# EAGLE design sharp_breakout_v1 (EAGLE 9.6.2)
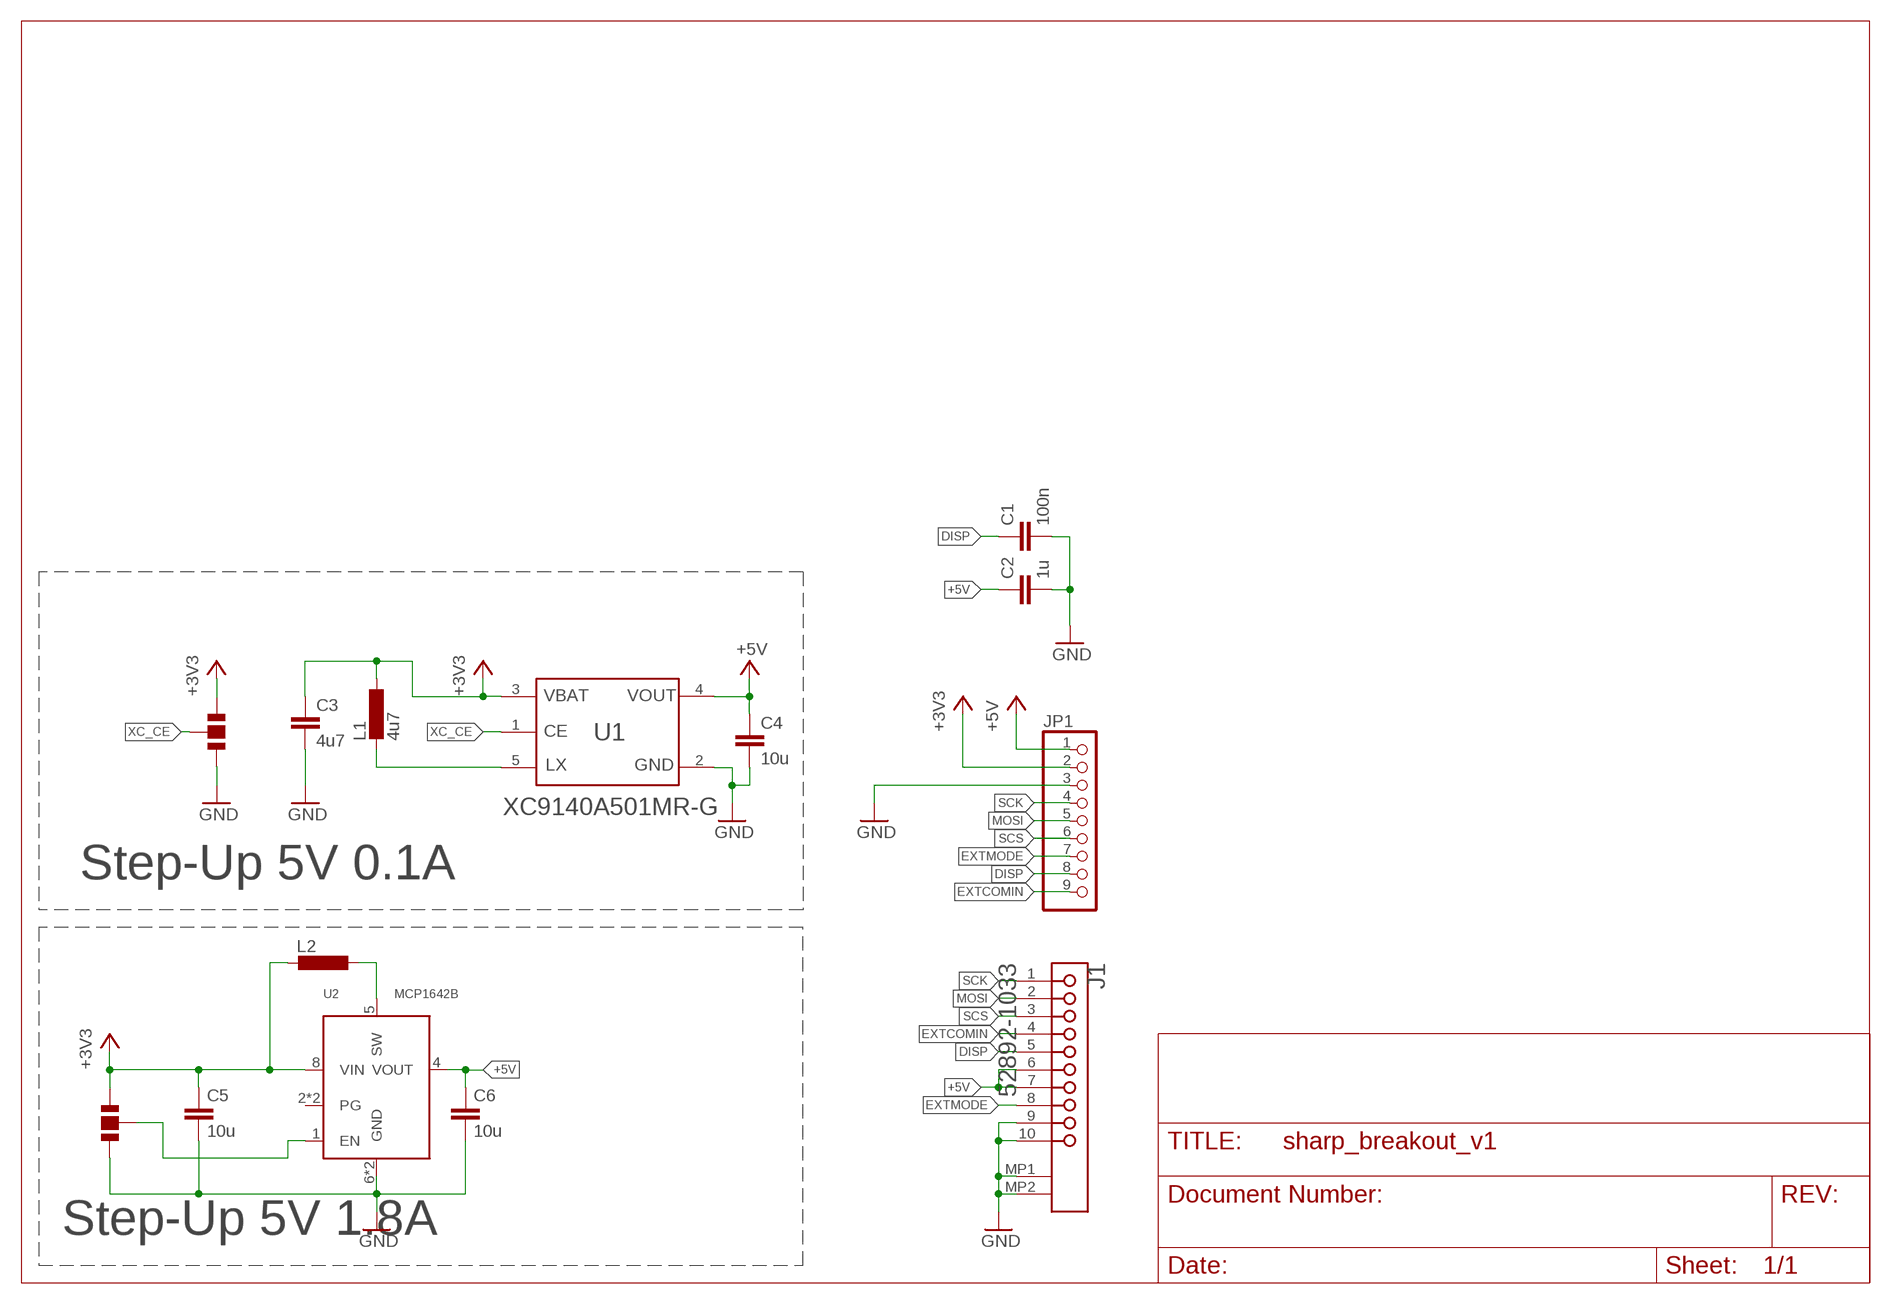
[diagram p0: schematic, sheet 1]

## Parts
C1  100n  C-EUC0603K  [C0603K]
C2  1u  C-EUC0603K  [C0603K]
C3  4u7  C-EUC0603K  [C0603K]
C4  10u  C-EUC0603K  [C0603K]
C5  10u  C-EUC1206  [C1206]
C6  10u  C-EUC1206  [C1206]
J1  MOLEX_52892-1033MOLEX_52892-1033_0_0  [MOLEX_52892-1033_0]
JP1  PINHD-1X9  [1X09]
L1  4u7  L-EUL3225M  [L3225M]
L2  L-EUL4532P  [L4532P]
U1  TOREX_XC9140A501MR-GTOREX_XC9140A501MR-G_0_0  [TOREX_XC9140A501MR-G_0]
U2  MCP1642B  [MSOP8]
U$1  JUMPER  [2-WAY]
U$7  JUMPER  [2-WAY]

## Nets
+3V3: C3.1 C5.1 JP1.2 L1.1 L2.2 U1.3(VBAT) U2.8(VIN) U$1.P$3 U$7.P$2
+5V: C2.1 C4.1 C6.1 J1.6 J1.7 JP1.1 U1.4(VOUT) U2.4(VOUT)
DISP: C1.1 J1.5 JP1.8
EXTCOMIN: J1.4 JP1.9
EXTMODE: J1.8 JP1.7
GND: C1.2 C2.2 C3.2 C4.2 C5.2 C6.2 J1.9 J1.10 J1.MP1 J1.MP2 JP1.3 U1.2(GND) U2.6(GND) U2.7(GND) U$1.P$2 U$7.P$3
MOSI: J1.2 JP1.5
N$4: L1.2 U1.5(LX)
N$21: L2.1 U2.5(SW)
N$23: U2.1(EN) U$7.P$1
SCK: J1.1 JP1.4
SCS: J1.3 JP1.6
XC_CE: U1.1(CE) U$1.P$1
Unconnected: U2.2(PG) U2.3(PG)

## Notes on the sheet
- Step-Up 5V 0.1A
- Step-Up 5V 1.8A

## Library data of the parts
C1-C6 = rcl:C-EU: CAPACITOR, European symbol; SPICEPREFIX: C
J1 = Bastlir:MOLEX_52892-1033: MOLX-52892-1033; CIIVA_IDS: 12958041; CIRCUITS_LOADED: 10; COMPONENT_LINK_1_DESCRIPTION: Manufacturer URL; COMPONENT_LINK_1_URL: http://www.molex.com/molex/index.jsp; COMPONENT_LINK_3_DESCRIPTION: Package Specification; COMPONENT_LINK_3_URL: http://www.molex.com/pdm_docs/sd/528921033_sd.pdf; CONTACT_POSITION: Bottom; CURRENT_MAX_PER_CONTACT: 0.5A; DATASHEET: http://www.molex.com/webdocs/datasheets/pdf/en-us/0528921033_FFC_FPC_CONNECTORS.pdf; DURABILITY_MATING_CYCLES_MAX: 20; ENTRY_ANGLE: 90degrees Angle; FOOTPRINT_VARIANT_NAME_0: Manufacturer Recommended; IMPORTED: yes; IMPORTED_FROM: vault; IMPORT_TS: 1521861772; MATED_HEIGHT: 2.00mm; MATERIAL___METAL: Phosphor Bronze; MATERIAL___PLATING_MATING: Silver, Tin-Bismuth; MATERIAL___PLATING_TERMINATION: Silver, Tin-Bismuth; MF: Molex; MOUNTING_TECHNOLOGY: Surface Mount; MPN: 52892-1033; NUMBER_OF_ROWS: 1; ORIENTATION: Right Angle; PACKAGE: 52892-1033; PACKAGE_DESCRIPTION: 10-Lead FPC Connector, Pitch 0.5 mm; PACKAGE_VERSION: Rev. A, 05/2013; PACKING: Tape and Reel; PCB_LOCATOR: No; PCB_RETENTION: Yes; PITCH___MATING_INTERFACE: 0.50mm; PITCH___TERMINATION_INTERFACE: 0.50mm; POLARIZED_TO_PCB: No; PREFIX: J; RELEASE_DATE: 1411372666; ROHS: Yes; STACKABLE: No; VAULT_GUID: ED90F1F9-BF1F-41FB-8C24-080009F071BA; VAULT_REVISION: 2519BB65-6747-4A90-BA56-D26D50506A67; VOLTAGE_MAX: 50V
JP1 = pinhead:PINHD-1X9: PIN HEADER
L1 L2 = rcl:L-EU: INDUCTOR, European symbol; SPICEPREFIX: L
U1 = Bastlir:TOREX_XC9140A501MR-G: Boost Switching Regulator IC Positive Fixed 5V 1 Output 295mA (Switch) SC-74A, SOT-753; AMBIENT_TEMPERATURE_RANGE_HIGH: +85°C; AMBIENT_TEMPERATURE_RANGE_LOW: -40°C; AUTOMOTIVE: No; CENTROID_NOT_SPECIFIED: No; DATASHEET: http://www.torexsemi.com/products/dcdc_converters/data/XC9140.pdf; DEVICE_CLASS_L1: Integrated Circuits (ICs); DEVICE_CLASS_L2: Power Management ICs; DEVICE_CLASS_L3: Voltage Regulators - Switching; DIGIKEY_DESCRIPTION: IC REG BOOST 5V 295MA SOT25; DIGIKEY_PART_NUMBER: 893-1181-1-ND; FOOTPRINT_PARAMETERS_1: {"fp_type":"SOT23","params":{"N":{"default":"5","long name":"Number of leads","type":"multichoice","short name":"N"},"A":{"nom":false,"long name":"Height","min":false,"max":1300000,"short name":"A","type":"measurement"},"A1":{"nom":50000,"long name":"Package clearance","min":0,"max":100000,"short name":"A1","type":"measurement"},"A2":{"nom":1100000,"long name":"Package height","min":1000000,"max":1200000,"short name":"A2","type":"measurement"},"D":{"nom":2900000,"long name":"Package length","min":2700000,"max":3100000,"short name":"D","type":"measurement"},"E":{"nom":2800000,"long name":"Width /w leads","min":2600000,"max":3000000,"short name":"E","type":"measurement"},"E1":{"nom":1600000,"long name":"Package width","min":1500000,"max":1800000,"short name":"E1","type":"measurement"},"B":{"nom":400000,"long name":"Lead width","min":350000,"max":500000,"short name":"B","type":"measurement"},"C":{"nom":150000,"long name":"Lead thickness","min":100000,"max":250000,"short name":"C","type":"measurement"},"L":{"nom":false,"long name":"Lead foot length","min":200000,"max":false,"short name":"L","type":"measurement"},"e":{"nom":950000,"long name":"Lead pitch","min":null,"max":null,"short name":"e","type":"measurement"},"PHI":{"nom":false,"long name":"Lead angle","min":0,"max":8,"short name":"PHI","type":"measurement"},"offset x":{"nom":0,"long name":"X Center offset","min":null,"max":null,"short name":"offset x","type":"measurement"},"offset y":{"nom":0,"long name":"Y Center offset","min":null,"max":null,"short name":"offset y","type":"measurement"},"LS":{"default":"Rounded rectangle","long name":"Land shape","type":"multichoice","short name":"LS"},"LS1":{"default":"Rectangle","long name":"Land shape (Pin 1)","type":"multichoice","short name":"LS1"},"solder toe":{"nom":550000,"long name":"Solder fillet (toe)","min":null,"max":null,"short name":"solder toe","type":"fixedmeasurement"},"solder heel":{"nom":450000,"long name":"Solder fillet (heel)","min":null,"max":null,"short name":"solder heel","type":"fixedmeasurement"},"solder side":{"nom":50000,"long name":"Solder fillet (side)","min":null,"max":null,"short name":"solder side","type":"fixedmeasurement"},"courtyard":{"nom":500000,"long name":"Courtyard","min":null,"max":null,"short name":"courtyard","type":"fixedmeasurement"},"SF":{"default":"A","long name":"Packing level","type":"multichoiceparent","short name":"SF","help":"http://support.upverter.com/customer/portal/articles/978783-what-is-a-footprint-packing-level","children":["solder toe","solder heel","solder side","courtyard"]}}}; FOOTPRINT_PARAMETERS_2: {"fp_type":"SOT23","params":{"N":{"default":"5","long name":"Number of leads","type":"multichoice","short name":"N"},"A":{"nom":false,"long name":"Height","min":false,"max":1300000,"short name":"A","type":"measurement"},"A1":{"nom":50000,"long name":"Package clearance","min":0,"max":100000,"short name":"A1","type":"measurement"},"A2":{"nom":1100000,"long name":"Package height","min":1000000,"max":1200000,"short name":"A2","type":"measurement"},"D":{"nom":2900000,"long name":"Package length","min":2700000,"max":3100000,"short name":"D","type":"measurement"},"E":{"nom":2800000,"long name":"Width /w leads","min":2600000,"max":3000000,"short name":"E","type":"measurement"},"E1":{"nom":1600000,"long name":"Package width","min":1500000,"max":1800000,"short name":"E1","type":"measurement"},"B":{"nom":400000,"long name":"Lead width","min":350000,"max":500000,"short name":"B","type":"measurement"},"C":{"nom":150000,"long name":"Lead thickness","min":100000,"max":250000,"short name":"C","type":"measurement"},"L":{"nom":false,"long name":"Lead foot length","min":200000,"max":false,"short name":"L","type":"measurement"},"e":{"nom":950000,"long name":"Lead pitch","min":null,"max":null,"short name":"e","type":"measurement"},"PHI":{"nom":false,"long name":"Lead angle","min":0,"max":8,"short name":"PHI","type":"measurement"},"offset x":{"nom":0,"long name":"X Center offset","min":null,"max":null,"short name":"offset x","type":"measurement"},"offset y":{"nom":0,"long name":"Y Center offset","min":null,"max":null,"short name":"offset y","type":"measurement"},"LS":{"default":"Rounded rectangle","long name":"Land shape","type":"multichoice","short name":"LS"},"LS1":{"default":"Rectangle","long name":"Land shape (Pin 1)","type":"multichoice","short name":"LS1"},"solder toe":{"nom":350000,"long name":"Solder fillet (toe)","min":null,"max":null,"short name":"solder toe","type":"fixedmeasurement"},"solder heel":{"nom":350000,"long name":"Solder fillet (heel)","min":null,"max":null,"short name":"solder heel","type":"fixedmeasurement"},"solder side":{"nom":30000,"long name":"Solder fillet (side)","min":null,"max":null,"short name":"solder side","type":"fixedmeasurement"},"courtyard":{"nom":250000,"long name":"Courtyard","min":null,"max":null,"short name":"courtyard","type":"fixedmeasurement"},"SF":{"default":"B","long name":"Packing level","type":"multichoiceparent","short name":"SF","help":"http://support.upverter.com/customer/portal/articles/978783-what-is-a-footprint-packing-level","children":["solder toe","solder heel","solder side","courtyard"]}}}; FOOTPRINT_PARAMETERS_3: {"fp_type":"SOT23","params":{"N":{"default":"5","long name":"Number of leads","type":"multichoice","short name":"N"},"A":{"nom":false,"long name":"Height","min":false,"max":1300000,"short name":"A","type":"measurement"},"A1":{"nom":50000,"long name":"Package clearance","min":0,"max":100000,"short name":"A1","type":"measurement"},"A2":{"nom":1100000,"long name":"Package height","min":1000000,"max":1200000,"short name":"A2","type":"measurement"},"D":{"nom":2900000,"long name":"Package length","min":2700000,"max":3100000,"short name":"D","type":"measurement"},"E":{"nom":2800000,"long name":"Width /w leads","min":2600000,"max":3000000,"short name":"E","type":"measurement"},"E1":{"nom":1600000,"long name":"Package width","min":1500000,"max":1800000,"short name":"E1","type":"measurement"},"B":{"nom":400000,"long name":"Lead width","min":350000,"max":500000,"short name":"B","type":"measurement"},"C":{"nom":150000,"long name":"Lead thickness","min":100000,"max":250000,"short name":"C","type":"measurement"},"L":{"nom":false,"long name":"Lead foot length","min":200000,"max":false,"short name":"L","type":"measurement"},"e":{"nom":950000,"long name":"Lead pitch","min":null,"max":null,"short name":"e","type":"measurement"},"PHI":{"nom":false,"long name":"Lead angle","min":0,"max":8,"short name":"PHI","type":"measurement"},"offset x":{"nom":0,"long name":"X Center offset","min":null,"max":null,"short name":"offset x","type":"measurement"},"offset y":{"nom":0,"long name":"Y Center offset","min":null,"max":null,"short name":"offset y","type":"measurement"},"LS":{"default":"Rounded rectangle","long name":"Land shape","type":"multichoice","short name":"LS"},"LS1":{"default":"Rectangle","long name":"Land shape (Pin 1)","type":"multichoice","short name":"LS1"},"solder toe":{"nom":150000,"long name":"Solder fillet (toe)","min":null,"max":null,"short name":"solder toe","type":"fixedmeasurement"},"solder heel":{"nom":250000,"long name":"Solder fillet (heel)","min":null,"max":null,"short name":"solder heel","type":"fixedmeasurement"},"solder side":{"nom":10000,"long name":"Solder fillet (side)","min":null,"max":null,"short name":"solder side","type":"fixedmeasurement"},"courtyard":{"nom":100000,"long name":"Courtyard","min":null,"max":null,"short name":"courtyard","type":"fixedmeasurement"},"SF":{"default":"C","long name":"Packing level","type":"multichoiceparent","short name":"SF","help":"http://support.upverter.com/customer/portal/articles/978783-what-is-a-footprint-packing-level","children":["solder toe","solder heel","solder side","courtyard"]}}}; FOOTPRINT_URL: https://www.torexsemi.com/file/SOT-25/SOT-25-pkg.pdf; FOOTPRINT_VARIANT_NAME_0: Recommended_Land_Pattern; FOOTPRINT_VARIANT_NAME_1: IPC_A; FOOTPRINT_VARIANT_NAME_2: IPC_B; FOOTPRINT_VARIANT_NAME_3: IPC_C; HEIGHT: 1.3mm; IPC_LAND_PATTERN_NAME: SOT95P280X130-5; IS_FEMALE: yes; LEAD_FREE: Yes; MAX_POWER_DISSIPATION: 250mW; MAX_SUPPLY_VOLTAGE: 5.5V; MF: Torex; MFG_PACKAGE_IDENT: 0; MFG_PACKAGE_IDENT_DATE: 0; MFG_PACKAGE_IDENT_REV: 0; MIN_SUPPLY_VOLTAGE: 0.7V; MOUSER_PART_NUMBER: 865-XC9140A501MR-G; MPN: XC9140A501MR-G; NOMINAL_SUPPLY_CURRENT: 6.3uA; NUMBER_OF_OUTPUTS: 1; OUTPUT_CURRENT: 100mA; OUTPUT_TYPE: Fixed; OUTPUT_VOLTAGE: 5V; PACKAGE: SOT25; PREFIX: U; ROHS: Yes; STANDOFF_HEIGHT: 0mm; SWITCHING_TOPOLOGY: Boost; TEMPERATURE_RANGE_HIGH: +85°C; TEMPERATURE_RANGE_LOW: -40°C; VERIFICATION_VERSION: 0.0.0.3
U2 = Bastlir:MCP1642B
U$1 U$7 = czech_maker:JUMPER

## Board
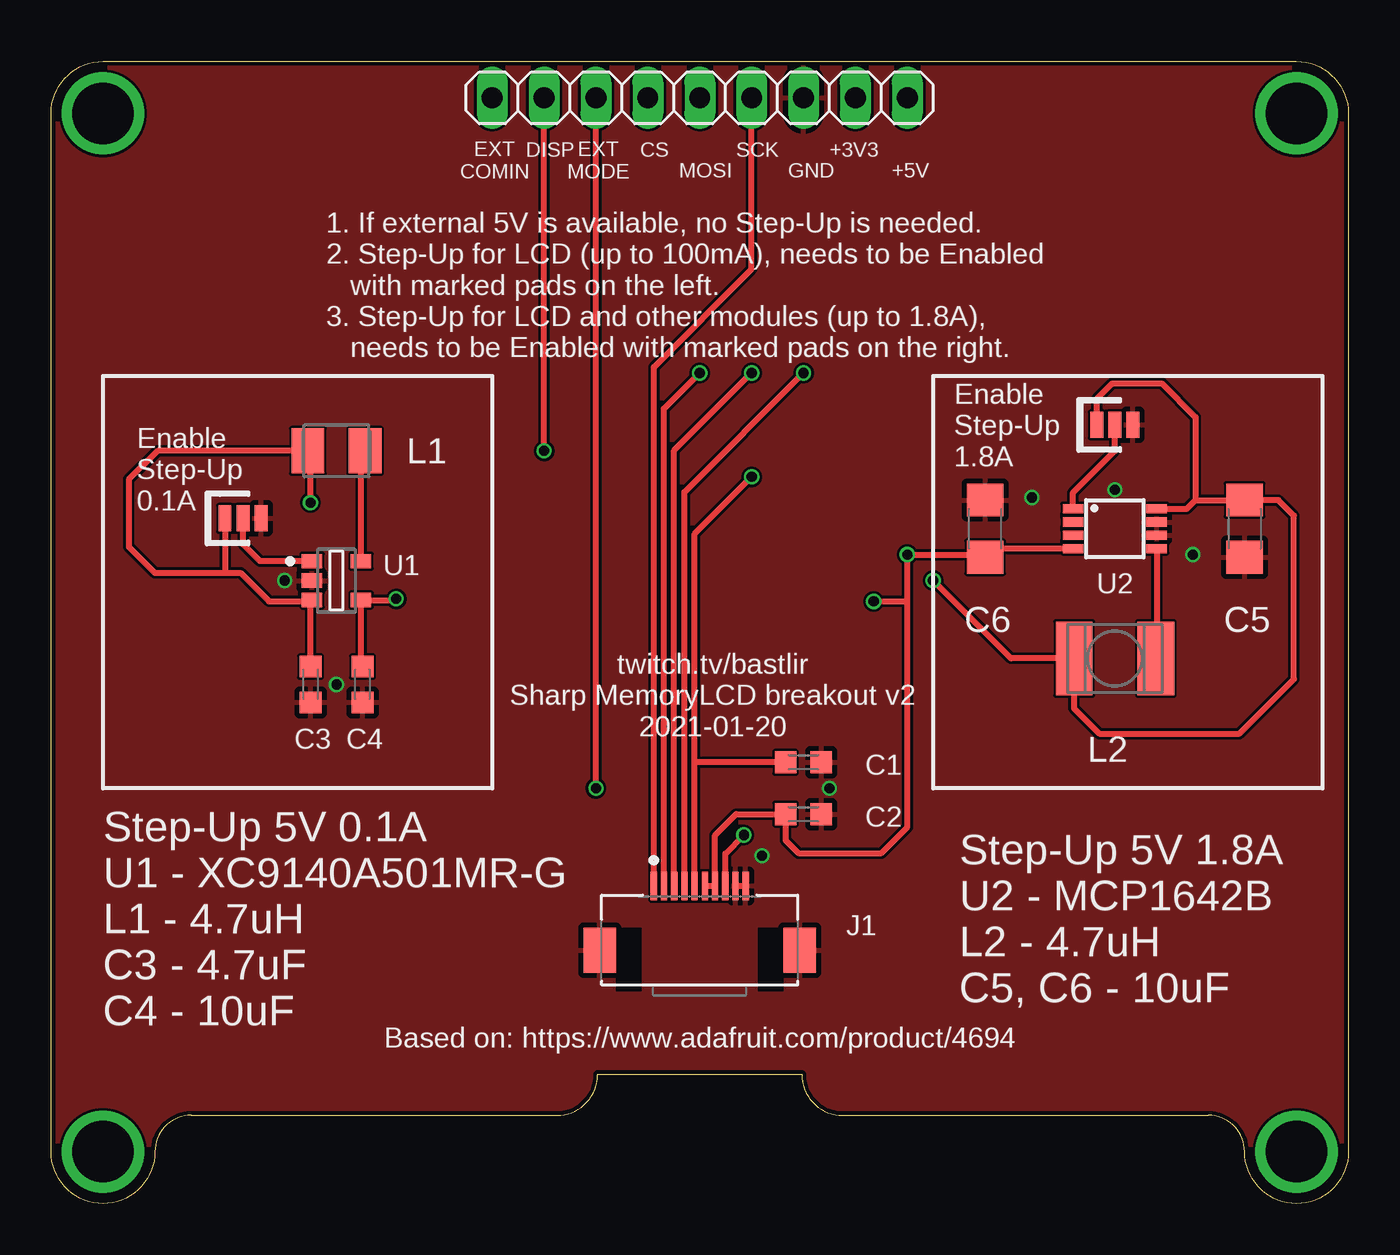
[diagram p1: board, top side]
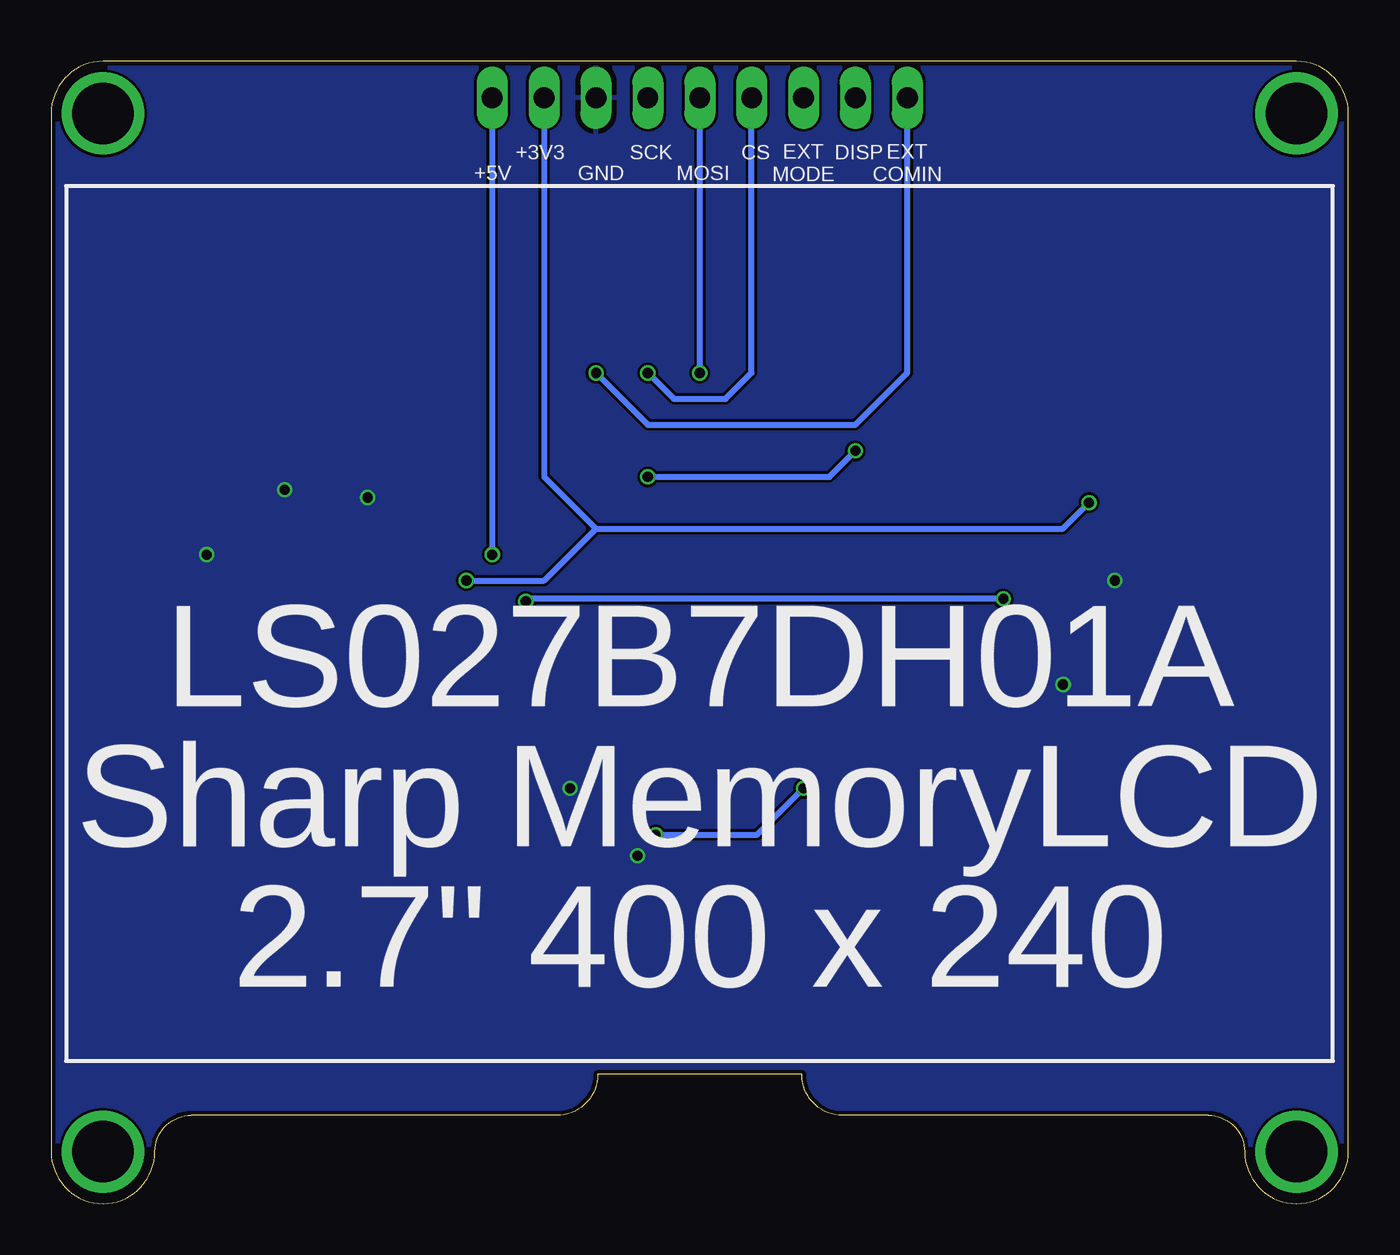
[diagram p2: board, bottom side, seen from below]

Size 63.5 x 55.88 mm. Coordinates in mm from the lower left corner, seen from the top.
Outline: 2.54,55.88 60.96,55.88 arc-90 63.5,53.34 63.5,2.54 arc-90 60.96,0 arc-90 58.42,2.54 arc90 56.64,4.32 38.75,4.32 arc-90 36.75,6.32 26.75,6.32 arc-90 24.75,4.32 6.86,4.32 arc90 5.08,2.54 arc-90 2.54,0 arc-90 0,2.54 0,53.34 arc-90 2.54,55.88
Copper layers (1*16): Top 0.035559375mm / dielectric 1.6mm / Bottom 0.035559375mm
Design rules "jlcpcb2layer": minimum track width 5mil, minimum drill 12mil, track to track 5mil, track to pad 5mil, pad to pad 5mil, via to via 5mil, smd to smd 5mil, copper to edge 8mil, drill to drill 6mil, minimum pad ring 5mil, minimum via ring 3mil, stop-mask expansion 2.5mil, vias tented up to drill 0mil, thermal gap 10mil

### Footprints (pad centres in the part's own frame; a part is rotated, then mirrored left to right if it is on the bottom)
C0603K = smd 1.05 x 1.08: 1 -0.875,0; 2 0.875,0
C1206 = smd 1.6 x 1.8: 1 -1.4,0; 2 1.4,0
MOLEX_52892-1033_0 = smd 0.3 x 1.4: 1 -2.25,1.575; 2 -1.75,1.575; 3 -1.25,1.575; 4 -0.75,1.575; 5 -0.25,1.575; 6 0.25,1.575; 7 0.75,1.575; 8 1.25,1.575; 9 1.75,1.575; 10 2.25,1.575 | smd 1.6 x 2.2: MP1 -4.9,-1.575; MP2 4.9,-1.575
1X09 = drill 1.016 long: 1 -10.16,0; 2 -7.62,0; 3 -5.08,0; 4 -2.54,0; 5 0,0; 6 2.54,0; 7 5.08,0; 8 7.62,0; 9 10.16,0
L3225M = smd 1.6 x 2.2: 1 -1.4,0; 2 1.4,0
L4532P = smd 1.8 x 3.6: 1 -2,0; 2 2,0
TOREX_XC9140A501MR-G_0 = smd 1 x 0.7: 1 -1.2,0.95; 2 -1.2,0; 3 -1.2,-0.95; 4 1.2,-0.95; 5 1.2,0.95
MSOP8 = smd 0.45 x 1: 1 -0.975,-2.05; 2 -0.325,-2.05; 3 0.325,-2.05; 4 0.975,-2.05; 5 0.975,2.05; 6 0.325,2.05; 7 -0.325,2.05; 8 -0.975,2.05
2-WAY = smd 0.635 x 1.27: P$1 0,0; P$2 0.889,0; P$3 -0.889,0

### Placement (x,y rotation side)
C1  36.83,21.59 0 top
C2  36.83,19.05 0 top
C3  12.7,25.4 270 top
C4  15.24,25.4 270 top
C5  58.42,33.02 270 top
C6  45.72,33.02 90 top
J1  31.75,13.97 0 top
JP1  31.75,54.1 180 top
L1  13.97,36.83 0 top
L2  52.07,26.67 180 top
U1  13.97,30.48 0 top
U2  52.07,33.02 270 top
U$1  9.4,33.53 0 top
U$7  52.07,38.1 180 top

### Tracks (layer width: path | path; a pad name or v marks a point on that pad's centre or on a via)
+3V3  (via drill 0.5)
  Top 0.305: C3.1 12.7,29.46 | 12.7,29.46 U1.3 | 12.7,29.46 10.67,29.46 9.27,30.86 8.51,30.86 | v12.7,34.29 12.7,36.7 L1.1 5.21,36.83 3.81,35.43 3.81,32.13 5.08,30.86 8.51,30.86 | U2.8 55.59,33.99 56.01,34.42 | 56.01,34.42 C5.1 60.07,34.42 60.83,33.66 60.83,25.65 58.17,22.99 51.31,22.99 50.07,24.23 L2.2 46.99,26.67 v43.18,30.48 | U$7.P$2 51.18,39.37 51.94,40.13 54.36,40.13 56.01,38.48 56.01,34.42 | U$1.P$3 8.51,30.86
  Bottom 0.305: JP1.2 39.37,35.56 36.83,33.02 | 36.83,33.02 13.97,33.02 v12.7,34.29 | v43.18,30.48 39.37,30.48 36.83,33.02
+5V  (via drill 0.5)
  Top 0.305: J1.6 J1.7 32.5,18.02 33.53,19.05 C2.1 35.95,17.77 36.58,17.14 40.64,17.14 41.91,18.41 41.91,29.46 | C4.1 15.17,26.34 U1.4 16.83,29.53 v16.89,29.59 | U2.4 46.15,32.05 C6.1 45.59,31.75 v41.91,31.75 41.91,29.46 | v40.26,29.46 41.91,29.46
  Bottom 0.305: JP1.1 v41.91,31.75 | v16.89,29.59 40.13,29.59 v40.26,29.46
DISP  (via drill 0.5)
  Top 0.305: J1.5 31.5,21.59 | 31.5,21.59 31.5,32.77 v34.29,35.56 | v24.13,36.83 JP1.8 | C1.1 31.5,21.59
  Bottom 0.305: v34.29,35.56 25.4,35.56 v24.13,36.83
EXTCOMIN  (via drill 0.5)
  Top 0.305: J1.4 31,34.81 v36.83,40.64
  Bottom 0.305: v36.83,40.64 34.29,38.1 24.13,38.1 21.59,40.64 JP1.9
EXTMODE  (via drill 0.5)
  Top 0.305: J1.8 33,17.12 v33.91,18.03 | v26.67,20.32 JP1.7
  Bottom 0.305: v33.91,18.03 28.96,18.03 v26.67,20.32
GND  (via drill 0.5)
  Top 0.305: J1.9 J1.10
  other vias: 13.97,25.4 11.43,30.48 55.88,31.75 52.07,34.92 48.01,34.54 38.1,20.32 34.8,17.02
  pour Top: -2.54,-1.27 64.77,-1.27 64.77,57.15 -2.54,57.15
  pour Bottom: -3.81,-2.54 66.04,-2.54 66.04,58.42 -3.81,58.42
MOSI  (via drill 0.5)
  Top 0.305: J1.2 30,38.89 v31.75,40.64
  Bottom 0.305: v31.75,40.64 JP1.5
N$1  (via drill 3)
  other vias: 2.54,53.34
N$2  (via drill 3)
  other vias: 60.96,53.34
N$3  (via drill 3)
  other vias: 60.96,2.54
N$4
  Top 0.305: U1.5 15.17,36.63 L1.2
N$5  (via drill 3)
  other vias: 2.54,2.54
N$21
  Top 0.305: U2.5 54.12,26.72 L2.1
N$23
  Top 0.305: U2.1 50.02,34.78 52.07,36.83 U$7.P$1
SCK
  Top 0.305: J1.1 29.5,40.93 34.29,45.72 JP1.4
SCS  (via drill 0.5)
  Top 0.305: J1.3 30.5,36.85 v34.29,40.64
  Bottom 0.305: v34.29,40.64 33.02,39.37 30.48,39.37 29.21,40.64 JP1.6
XC_CE
  Top 0.305: U$1.P$1 9.4,32.26 10.23,31.43 U1.1

### Text on the board
tPlace: 1. If external 5V is available, no Step-Up is needed. / 2. Step-Up for LCD (up to 100mA), needs to be Enabled / with marked pads on the left. / 3. Step-Up for LCD and other modules (up to 1.8A), / needs to be Enabled with marked pads on the right. | Enable / Step-Up / 1.8A | Enable / Step-Up / 0.1A | twitch.tv/bastlir / Sharp MemoryLCD breakout v2 / 2021-01-20 | Step-Up 5V 0.1A / U1 - XC9140A501MR-G / L1 - 4.7uH / C3 - 4.7uF / C4 - 10uF | Step-Up 5V 1.8A / U2 - MCP1642B / L2 - 4.7uH / C5, C6 - 10uF | Based on: https://www.adafruit.com/product/4694
bPlace: LS027B7DH01A / Sharp MemoryLCD / 2.7" 400 x 240
tNames: DISP | CS | SCK | +3V3 | EXT / COMIN | EXT / MODE | MOSI | GND | +5V
bNames: EXT / COMIN | DISP | EXT / MODE | CS | SCK | +3V3 | MOSI | GND | +5V